# EAGLE board 6_channel_esp32_energy_meter (EAGLE 9.6.2)
CREVISION: 1.0; DESIGNER: Tisham Dhar
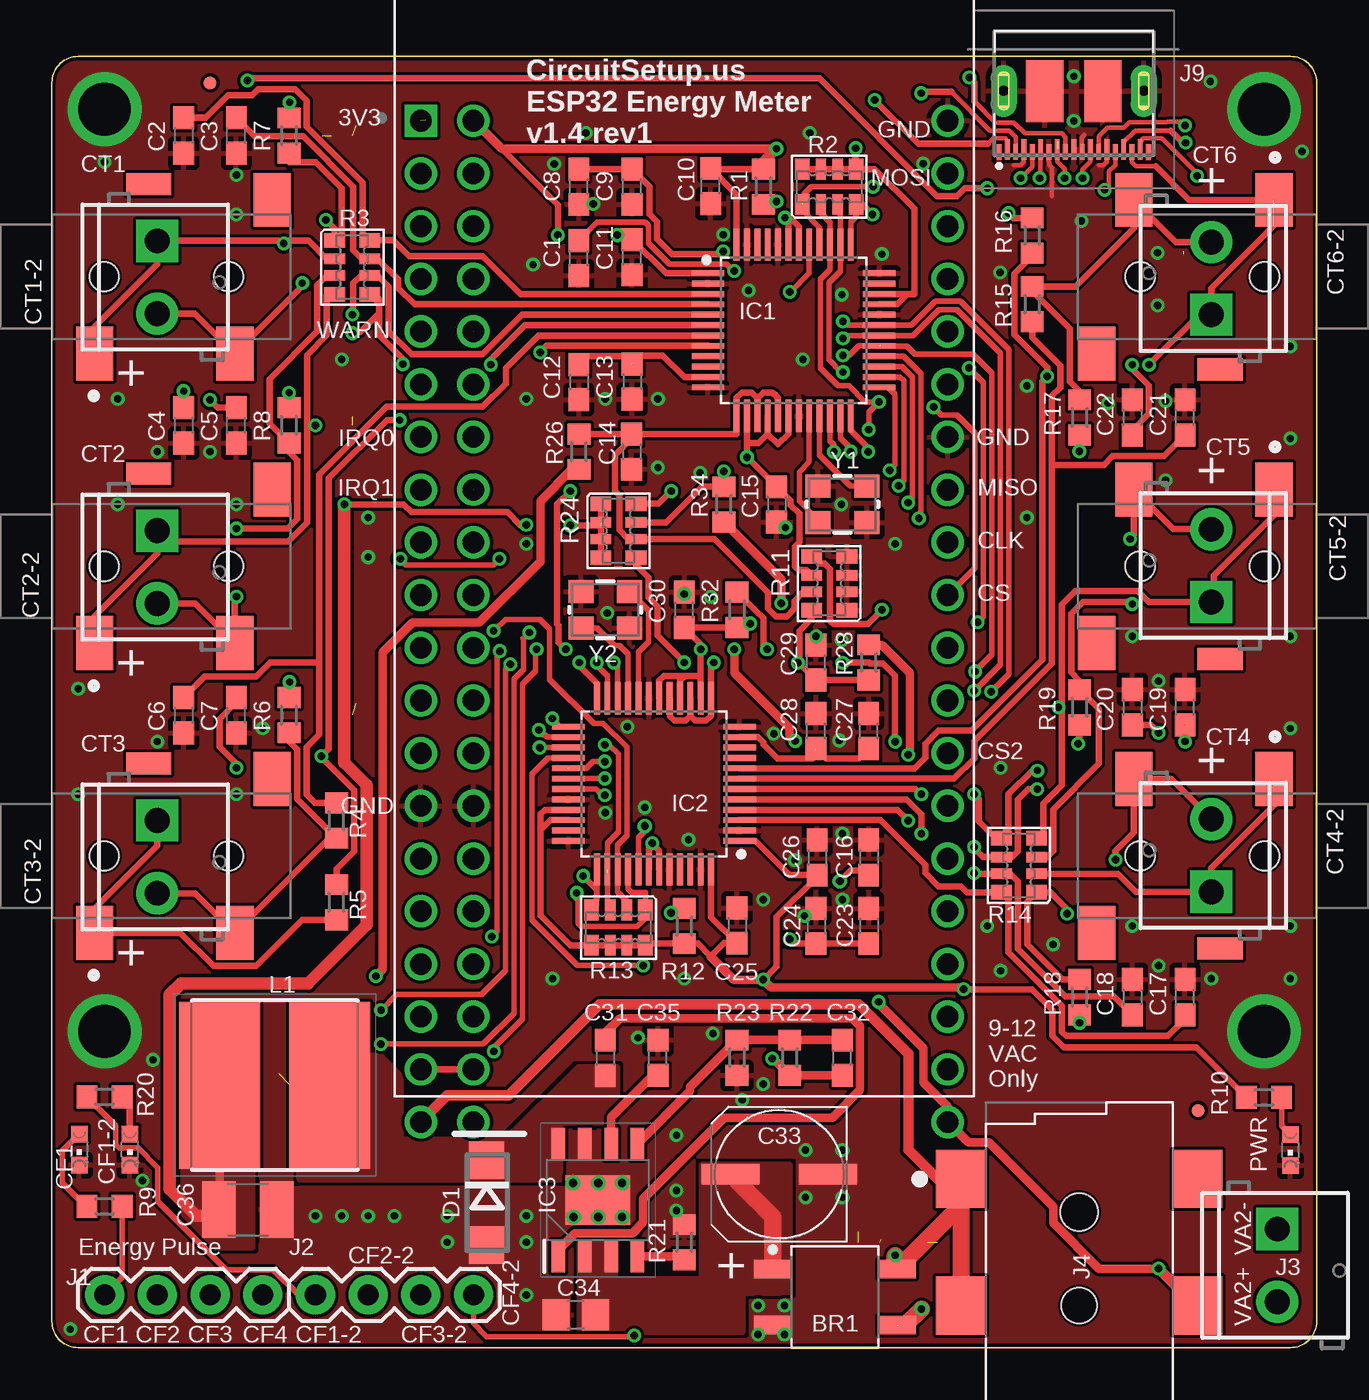
[diagram p3: board, top side]
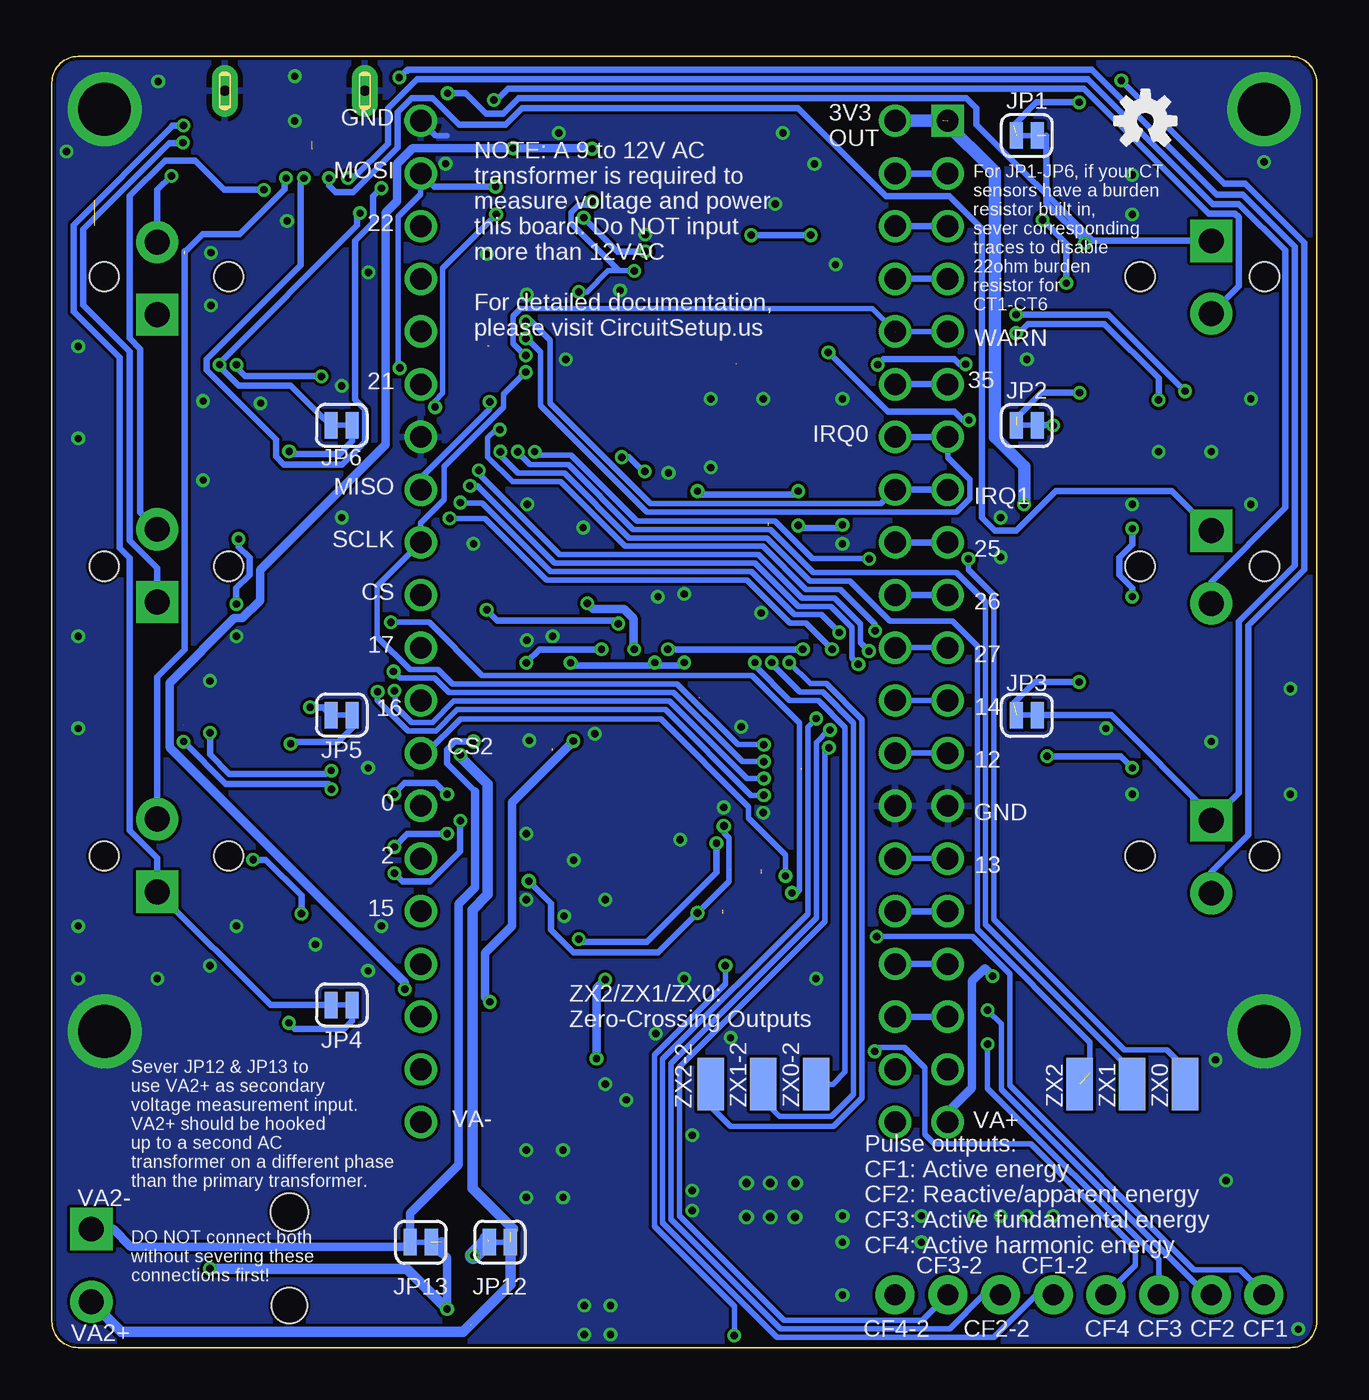
[diagram p4: board, bottom side, seen from below]

Size 60.96 x 62.23 mm. Coordinates in mm from the lower left corner, seen from the top.
Outline: 60.96,60.96 60.96,1.27 arc-90 59.69,0 1.27,0 arc-90 0,1.27 0,60.96 arc-90 1.27,62.23 59.69,62.23 arc-90 60.96,60.96
Copper layers (1*16): Top 0.035mm / dielectric 1.5mm / Bottom 0.035mm
Design rules "hackvana *": minimum track width 5mil, minimum drill 0.3mm, track to track 6mil, track to pad 6mil, pad to pad 6mil, via to via 6mil, smd to smd 0mil, copper to edge 6mil, drill to drill 6mil, minimum pad ring 8mil, minimum via ring 6mil, stop-mask expansion 4mil, vias tented up to drill 25mil, thermal gap 10mil
Net classes: 0 default: width 0.152 mm, drill 0.33 mm, clearance 0.152 mm; 1 pwr: width 0.305 mm, drill 0.356 mm, clearance 0.152 mm; 2 analog: width 0.203 mm, drill 0.33 mm, clearance 0.152 mm

## Footprints (pad centres in the part's own frame; a part is rotated, then mirrored left to right if it is on the bottom)
SOP270P700X270-4 = smd 1.803 x 0.88: 1 -3.005,1.35; 2 -3.005,-1.35; 3 3.005,-1.35; 4 3.005,1.35
C0603 = smd 1.1 x 1: 1 -0.85,0; 2 0.85,0
UD-6,3X7,7_NICHICON = smd 2.8 x 1: + 2.35,0; - -2.35,0
C0805 = smd 1.3 x 1.5: 1 -0.95,0; 2 0.95,0
C1210 = smd 1.6 x 2.7: 1 -1.4,0; 2 1.4,0
CHIPLED_0603 = smd 0.8 x 0.8: A 0,-0.75; C 0,0.75
SCREWTERMINAL-3.5MM-2 = drill 1.2 pad 2.032 square: 1 0,0 | drill 1.2 pad 2.032: 2 3.5,0
CUI_SJ2-35813B-SMT-TR = smd 1.8 x 2.6: 1 -3.7,-3.7; 2 3.05,-3.7; 10 4.85,3.7 | smd 2.184 x 1.067: 3 -1.1,4.462 | hole 1.4: -3.25,0; 2.75,0
DO214AC = smd 1.8 x 1.7: A 2.05,0; C -2.05,0
FIDUCIAL-MICRO = smd 0.635 x 0.635: 1 0,0
QFP50P900X900X120-48 = smd 1.558 x 0.28: 1 -4.127,2.75; 2 -4.127,2.25; 3 -4.127,1.75; 4 -4.127,1.25; 5 -4.127,0.75; 6 -4.127,0.25; 7 -4.127,-0.25; 8 -4.127,-0.75; 9 -4.127,-1.25; 10 -4.127,-1.75; 11 -4.127,-2.25; 12 -4.127,-2.75; 25 4.127,-2.75; 26 4.127,-2.25; 27 4.127,-1.75; 28 4.127,-1.25; 29 4.127,-0.75; 30 4.127,-0.25; 31 4.127,0.25; 32 4.127,0.75; 33 4.127,1.25; 34 4.127,1.75; 35 4.127,2.25; 36 4.127,2.75 | smd 0.28 x 1.558: 13 -2.75,-4.127; 14 -2.25,-4.127; 15 -1.75,-4.127; 16 -1.25,-4.127; 17 -0.75,-4.127; 18 -0.25,-4.127; 19 0.25,-4.127; 20 0.75,-4.127; 21 1.25,-4.127; 22 1.75,-4.127; 23 2.25,-4.127; 24 2.75,-4.127; 37 2.75,4.127; 38 2.25,4.127; 39 1.75,4.127; 40 1.25,4.127; 41 0.75,4.127; 42 0.25,4.127; 43 -0.25,4.127; 44 -0.75,4.127; 45 -1.25,4.127; 46 -1.75,4.127; 47 -2.25,4.127; 48 -2.75,4.127
SOIC127P600X170-9N = smd 1.525 x 0.65: 1 -2.712,1.905; 2 -2.712,0.635; 3 -2.712,-0.635; 4 -2.712,-1.905; 5 2.712,-1.905; 6 2.712,-0.635; 7 2.712,0.635; 8 2.712,1.905 | smd 2.4 x 3.1: 9 0,0
1X04 = drill 1.016 pad 1.88: 1 0,0; 2 2.54,0; 3 5.08,0; 4 7.62,0
CUI_PJ-002AH-SMT-TR = smd 2.8 x 2.4: 1A 0,0; 1B -6.1,0; 2 -6.1,-11.4; 3 0,-11.4 | hole 1.7: -6.1,-5.7 | hole 1.8: -1.6,-5.7
1X01-SM = drill 1.04: 1 0,0
PKS01940110 = smd 0.23 x 0.75: 1 3.6,5.825; 3 2.8,5.825; 5 2,5.825; 7 1.2,5.825; 9 0.4,5.825; 11 -0.4,5.825; 13 -1.2,5.825; 15 -2,5.825; 17 -2.8,5.825; 19 -3.6,5.825 | smd 0.23 x 1: 2 3.2,5.7; 4 2.4,5.7; 6 1.6,5.7; 8 0.8,5.7; 10 0,5.7; 12 -0.8,5.7; 14 -1.6,5.7; 16 -2.4,5.7; 18 -3.2,5.7 | smd 1.8 x 3: 21 -1.4,2.9; 22 1.4,2.9 | drill 0.5 pad 1.25 long: P$1 -3.375,2.875; P$2 3.375,2.875
1X19 = drill 1.04: 1 0,0; 2 2.54,0; 3 5.08,0; 4 7.62,0; 5 10.16,0; 6 12.7,0; 7 15.24,0; 8 17.78,0; 9 20.32,0; 10 22.86,0; 11 25.4,0; 12 27.94,0; 13 30.48,0; 14 33.02,0; 15 35.56,0; 16 38.1,0; 17 40.64,0; 18 43.18,0; 19 45.72,0
SMT-JUMPER_2_NC_TRACE_SILK = smd 0.635 x 1.27: 1 -0.508,0; 2 0.508,0
INDPM8082X300N = smd 3.9 x 8.05: 1 -2.65,0; 2 2.65,0
R0603 = smd 1 x 1.1: 1 -0.85,0; 2 0.85,0
RA1206-8 = smd 0.7 x 1: 1 -1.3,-0.85; 4 1.3,-0.85; 5 1.3,0.85; 8 -1.3,0.85 | smd 0.5 x 1: 2 -0.4,-0.85; 3 0.4,-0.85; 6 0.4,0.85; 7 -0.4,0.85
MODULE_ESP32-DEVKITC-32D = drill 1.04 square: 1 -12.7,19.76 | drill 1.04: 2 -12.7,17.22; 3 -12.7,14.68; 4 -12.7,12.14; 5 -12.7,9.6; 6 -12.7,7.06; 7 -12.7,4.52; 8 -12.7,1.98; 9 -12.7,-0.56; 10 -12.7,-3.1; 11 -12.7,-5.64; 12 -12.7,-8.18; 13 -12.7,-10.72; 14 -12.7,-13.26; 15 -12.7,-15.8; 16 -12.7,-18.34; 17 -12.7,-20.88; 18 -12.7,-23.42; 19 -12.7,-25.96; 20 12.7,19.76; 21 12.7,17.22; 22 12.7,14.68; 23 12.7,12.14; 24 12.7,9.6; 25 12.7,7.06; 26 12.7,4.52; 27 12.7,1.98; 28 12.7,-0.56; 29 12.7,-3.1; 30 12.7,-5.64; 31 12.7,-8.18; 32 12.7,-10.72; 33 12.7,-13.26; 34 12.7,-15.8; 35 12.7,-18.34; 36 12.7,-20.88; 37 12.7,-23.42; 38 12.7,-25.96
CRYSTAL-SMD-3.2X2.5MM = smd 1.2 x 1.1: 1 -1.175,-0.875; 2 1.175,-0.875; 3 1.175,0.875; 4 -1.175,0.875
SMD1,27-2,54 = smd 1.27 x 2.54: 1 0,0

## Placement (x,y rotation side)
BR1  50V/2A  [SOP270P700X270-4]  37.74,2.44 0 top
C1  0.1uF  [C0603]  25.4,52.51 90 top
C2  18nf  [C0603]  6.35,58.42 270 top
C3  18nf  [C0603]  8.89,58.42 90 top
C4  18nf  [C0603]  6.35,44.45 270 top
C5  18nf  [C0603]  8.89,44.45 90 top
C6  18nf  [C0603]  6.35,30.48 270 top
C7  18nf  [C0603]  8.89,30.48 90 top
C8  10uF  [C0603]  25.4,55.95 90 top
C9  0.1uF  [C0603]  27.97,55.95 90 top
C10  0.1uF  [C0603]  31.75,55.98 90 top
C11  0.1uF  [C0603]  27.97,52.55 90 top
C12  10uF  [C0603]  25.4,46.53 270 top
C13  0.1uF  [C0603]  27.97,46.56 270 top
C14  18nF  [C0603]  27.94,43.18 270 top
C15  18nF  [C0603]  34.92,40.64 270 top
C16  0.1uF  [C0603]  39.37,23.62 270 top
C17  18nf  [C0603]  54.61,16.89 90 top
C18  18nf  [C0603]  52.07,16.89 270 top
C19  18nf  [C0603]  54.61,30.86 90 top
C20  18nf  [C0603]  52.07,30.86 270 top
C21  18nf  [C0603]  54.61,44.83 90 top
C22  18nf  [C0603]  52.07,44.83 270 top
C23  10uF  [C0603]  39.37,20.32 270 top
C24  0.1uF  [C0603]  36.83,20.32 270 top
C25  0.1uF  [C0603]  33.02,20.35 270 top
C26  0.1uF  [C0603]  36.88,23.62 270 top
C27  10uF  [C0603]  39.37,29.72 90 top
C28  0.1uF  [C0603]  36.83,29.72 90 top
C29  18nF  [C0603]  36.83,33.02 90 top
C30  18nF  [C0603]  30.48,35.56 90 top
C31  0.1uF  [C0603]  26.67,13.97 270 top
C32  220pF  [C0603]  38.1,13.97 90 top
C33  100uF/25V  [UD-6,3X7,7_NICHICON]  35.05,8.36 180 top
C34  10uF/25V  [C0805]  25.25,1.57 180 top
C35  10nF  [C0603]  29.21,13.97 90 top
C36  100uF/6.3V/1210  [C1210]  9.45,6.65 0 top
CF1  BLU  [CHIPLED_0603]  1.32,9.55 180 top
CF1-2  BLU  [CHIPLED_0603]  3.76,9.55 180 top
CT1  [SCREWTERMINAL-3.5MM-2]  5.08,53.34 270 top
CT1-2  SJ2-35813B-SMT-TR  [CUI_SJ2-35813B-SMT-TR]  5.77,51.61 0 top
CT2  [SCREWTERMINAL-3.5MM-2]  5.08,39.37 270 top
CT2-2  SJ2-35813B-SMT-TR  [CUI_SJ2-35813B-SMT-TR]  5.77,37.66 0 top
CT3  [SCREWTERMINAL-3.5MM-2]  5.08,25.4 270 top
CT3-2  SJ2-35813B-SMT-TR  [CUI_SJ2-35813B-SMT-TR]  5.77,23.7 0 top
CT4  [SCREWTERMINAL-3.5MM-2]  55.88,21.97 90 top
CT4-2  SJ2-35813B-SMT-TR  [CUI_SJ2-35813B-SMT-TR]  55.19,23.7 180 top
CT5  [SCREWTERMINAL-3.5MM-2]  55.88,35.94 90 top
CT5-2  SJ2-35813B-SMT-TR  [CUI_SJ2-35813B-SMT-TR]  55.19,37.66 180 top
CT6  [SCREWTERMINAL-3.5MM-2]  55.88,49.78 90 top
CT6-2  SJ2-35813B-SMT-TR  [CUI_SJ2-35813B-SMT-TR]  55.19,51.61 180 top
D1  [DO214AC]  20.95,6.99 270 top
FD1  FIDUCIALUFIDUCIAL  [FIDUCIAL-MICRO]  7.62,60.96 0 top
FD2  FIDUCIALUFIDUCIAL  [FIDUCIAL-MICRO]  55.24,11.43 0 top
IC1  ATM90E32AS  [QFP50P900X900X120-48]  35.75,49.03 0 top
IC2  ATM90E32AS  [QFP50P900X900X120-48]  29.02,27.17 180 top
IC3  LMR14020SDDA  [SOIC127P600X170-9N]  26.31,7.11 90 top
J1  [1X04]  10.16,2.54 180 top
J2  [1X04]  20.32,2.54 180 top
J3  [SCREWTERMINAL-3.5MM-2]  59.05,5.71 270 top
J4  9-12VAC  [CUI_PJ-002AH-SMT-TR]  43.81,8.13 90 top
J5  PINHD1X1-SM1X01_SM  [1X01-SM]  20.32,10.87 0 top
J6  PINHD1X1-SM1X01_SM  [1X01-SM]  43.18,10.87 0 top
J8  PINHD1X1-SM1X01_SM  [1X01-SM]  17.78,10.87 0 top
J9  PKS019-4011-0  [PKS01940110]  49.25,63.45 180 top
J16  PINHD-1X19  [1X19]  20.32,59.13 270 top
JP1  [SMT-JUMPER_2_NC_TRACE_SILK]  13.97,58.42 0 bottom
JP2  [SMT-JUMPER_2_NC_TRACE_SILK]  13.97,44.45 0 bottom
JP3  [SMT-JUMPER_2_NC_TRACE_SILK]  13.97,30.48 0 bottom
JP4  [SMT-JUMPER_2_NC_TRACE_SILK]  46.99,16.51 180 bottom
JP5  [SMT-JUMPER_2_NC_TRACE_SILK]  46.99,30.48 180 bottom
JP6  [SMT-JUMPER_2_NC_TRACE_SILK]  46.99,44.45 180 bottom
JP12  [SMT-JUMPER_2_NC_TRACE_SILK]  39.37,5.08 180 bottom
JP13  [SMT-JUMPER_2_NC_TRACE_SILK]  43.18,5.08 0 bottom
L1  3.3uH / 8x8mm  [INDPM8082X300N]  10.74,12.65 180 top
LOGO1  OSHW-LOGOS  [OSHW-LOGO-S]  8.26,59.12 0 bottom
PWR  GRN  [CHIPLED_0603]  59.69,9.53 180 top
R1  10K  [R0603]  34.29,55.95 270 top
R2  10K  [RA1206-8]  37.47,55.95 0 top
R3  100  [RA1206-8]  14.48,52.07 270 top
R4  100  [R0603]  13.72,25.4 270 top
R5  100  [R0603]  13.72,21.46 270 top
R6  22  [R0603]  11.43,30.48 270 top
R7  22  [R0603]  11.43,58.42 270 top
R8  22  [R0603]  11.43,44.45 270 top
R9  1k  [R0603]  2.54,6.81 0 top
R10  1k  [R0603]  58.42,12.06 180 top
R11  1K  [RA1206-8]  37.47,36.83 90 top
R12  10K  [R0603]  30.48,20.32 90 top
R13  10K  [RA1206-8]  27.3,20.24 180 top
R14  100  [RA1206-8]  46.61,23.24 90 top
R15  100  [R0603]  47.24,50.29 90 top
R16  100  [R0603]  47.24,53.59 90 top
R17  22  [R0603]  49.53,44.83 90 top
R18  22  [R0603]  49.53,16.89 90 top
R19  22  [R0603]  49.53,30.86 90 top
R20  1k  [R0603]  2.54,12.09 180 top
R21  20k  [R0603]  30.48,5.08 270 top
R22  34k  [R0603]  35.56,13.97 270 top
R23  10k  [R0603]  33.02,13.97 90 top
R24  20K  [RA1206-8]  27.3,39.37 270 top
R26  20k 1/4W  [R0603]  25.4,43.18 270 top
R28  20k 1/4W  [R0603]  39.37,33.02 90 top
R32  20k 1/4W  [R0603]  33.02,35.56 90 top
R34  20k 1/4W  [R0603]  32.38,40.64 270 top
U1  ESP32-DEVKITC-32D  [MODULE_ESP32-DEVKITC-32D]  30.48,39.37 0 top
Y1  16.384MHz  [CRYSTAL-SMD-3.2X2.5MM]  38.1,40.64 0 top
Y2  16.384MHz  [CRYSTAL-SMD-3.2X2.5MM]  26.67,35.56 180 top
ZX0  WIREPADSMD1,27-254  [SMD1,27-2,54]  6.35,12.7 0 bottom
ZX0-2  WIREPADSMD1,27-254  [SMD1,27-2,54]  24.13,12.7 0 bottom
ZX1  WIREPADSMD1,27-254  [SMD1,27-2,54]  8.89,12.7 0 bottom
ZX1-2  WIREPADSMD1,27-254  [SMD1,27-2,54]  26.67,12.7 0 bottom
ZX2  WIREPADSMD1,27-254  [SMD1,27-2,54]  11.43,12.7 0 bottom
ZX2-2  WIREPADSMD1,27-254  [SMD1,27-2,54]  29.21,12.7 0 bottom

## Tracks (layer width: path | path; a pad name or v marks a point on that pad's centre or on a via)
!CS  (via drill 0.36)
  Top 0.254: R2.4 38.77,54.54 38.5,54.27 IC1.37 | v42.49,45.33 42.88,44.95 43.62,44.95 44.49,44.08 44.49,37.58 U1.29
  Top 0.305: v39.55,54.61 39.06,55.1 R2.4
  Bottom 0.254: v42.49,45.33 42.49,45.62 42.12,45.99 42.12,52.04 v39.55,54.61
!CS-2  (via drill 0.35)
  Top 0.254: 26,21.32 26.27,21.59 IC2.37 | R13.4 26.26,21.35 26.26,22.08 v25.6,22.73
  Top 0.305: 26,21.32 R13.4
  Bottom 0.254: v25.6,22.73 25.6,23.75 27.38,25.53 27.38,26.07 31.61,30.3 41.27,30.3 42.93,28.65 U1.32
!RESET  (via drill 0.36)  (1 unrouted)
  Top 0.254: v35.56,50.88 35.59,50.88 36.5,51.79 IC1.41 | 28.59,54.23 28.58,54.23 | 28.58,54.23 26.27,54.23 C1.2 | 28.58,54.23 28.75,54.07 28.75,53.23 29.77,52.21 32.51,52.21 32.82,51.9 v32.88,51.9
  Top 0.305: R1.2 34.78,55.1 v34.92,55.24
  Bottom 0.254: v35.56,50.88 35.17,50.88 34.16,51.9 v32.88,51.9 33.63,51.9 35.94,54.2 35.94,54.71 35.58,55.07 35.1,55.07 v34.92,55.24
!RESET2  (via drill 0.38)  (1 unrouted)
  Top 0.254: IC2.41 28.27,24.59 28.57,24.89 v28.57,25.13 | R12.2 30.27,20.95 v29.84,20.95
  Top 0.305: C16.2 39.16,22.99 38.48,22.99 v37.97,22.48
  Bottom 0.254: v28.57,25.13 28.57,24.81 28.32,24.56 28.32,22.48 v29.84,20.95
  Bottom 0.305: v37.97,22.48 36.9,21.41 36.9,20.13 35.82,19.05 31.75,19.05 v29.84,20.95
BOOT
  Top 0.406: C31.1 26.67,15.16 27.38,15.88 38.59,15.88 38.96,15.52 38.96,12.42 37.61,11.08 32.4,11.08 28.5,7.18 28.5,6.04 27.97,5.52 25.21,5.52 24.41,4.72 IC3.1
CF1  (via drill 0.36)
  Top 0.254: IC1.25 40.31,46.28 40.62,45.97 40.62,42.53 v40.38,42.28 | v21.21,19.81 21.46,20.06 21.46,33.44 | R9.2 3.39,3.39 J1.4
  Top 0.305: v21.58,33.57 21.46,33.44
  Bottom 0.254: J1.4 2.54,2.62 3.67,3.76 5.92,3.76 14.8,12.64 14.8,18.01 16.6,19.81 v21.21,19.81 | v21.58,33.57 22,33.98 22,34.88 23.25,36.14 24.82,36.14 26.89,38.21 36.48,38.21 40.38,42.11 v40.38,42.28
CF1-2  (via drill 0.36)  (2 unrouted)
  Top 0.254: IC2.25 24.52,29.92 v24.12,30.32 | R20.2 3.08,10.7 3.08,9.79 3.24,9.62 4.16,9.62 5.11,8.68 5.11,7.05 8.4,3.76 10.66,3.76 11.88,2.54 J2.4
  Bottom 0.254: J2.4 13.52,2.54 15.55,0.51 26.01,0.51 31.52,6.02 31.52,13.92 24.53,20.91 24.53,29.92 v24.12,30.32
CF2  (via drill 0.35, 0.36)
  Top 0.254: IC1.26 40.88,46.78 41.06,46.6 41.06,41.79 v40.81,41.54 | v22.09,32.94 21.86,32.71 21.86,18.18 20.71,17.02 16.62,17.02 v15.86,16.26
  Bottom 0.254: v15.86,16.26 15.2,15.6 15.2,12.45 5.29,2.54 J1.3 | v40.81,41.54 40.47,41.54 36.74,37.81 27.06,37.81 24.98,35.73 23.42,35.73 22.4,34.72 22.4,33.25 v22.09,32.94
CF2-2  (via drill 0.36)
  Top 0.254: IC2.26 23.87,29.42 23.76,29.53 23.7,29.53 v23.46,29.77
  Bottom 0.254: J2.3 16.06,2.54 17.68,0.91 25.84,0.91 31.11,6.18 31.11,13.71 24.12,20.7 24.12,29.17 23.52,29.77 v23.46,29.77
CF3  (via drill 0.36)
  Top 0.254: IC1.27 40.97,47.28 41.48,46.78 41.48,40.93 v41.27,40.73 | 22.73,34.18 22.73,32.67 22.27,32.22 22.27,16.11 20.79,14.63 v15.86,14.63
  Top 0.305: v23.01,34.46 22.73,34.18
  Bottom 0.254: v41.27,40.73 41.25,40.7 40.23,40.7 36.93,37.4 27.25,37.4 25.17,35.32 23.87,35.32 v23.01,34.46 | v15.86,14.63 15.86,12.5 7.62,4.26 J1.2
CF3-2  (via drill 0.36)
  Top 0.254: IC2.27 v23.51,28.92
  Bottom 0.254: v23.51,28.92 23.71,28.72 23.71,20.53 30.71,13.54 30.71,6.35 25.67,1.32 19,1.32 J2.2
CF4  (via drill 0.35, 0.36)  (1 unrouted)
  Top 0.254: v41.79,39.97 41.88,40.06 41.88,46.95 41.05,47.78 IC1.28 | 23.31,33.61 23.31,32.61 22.68,31.97 22.68,15.84 21.3,14.46 v21.3,14.28
  Top 0.305: v23.36,33.66 23.31,33.61
  Bottom 0.254: J1.1 8.74,3.96 8.74,4.78 13.77,9.81 18.43,9.81 18.89,10.27 18.89,13.48 19.88,14.47 21.14,14.47 21.3,14.31 v21.3,14.28 | v41.79,39.97 40.09,39.97 37.12,36.99 27.46,36.99 25.38,34.92 24.61,34.92 v23.36,33.66
CF4-2  (via drill 0.35, 0.36)
  Top 0.254: IC2.28 23.91,28.42 23.13,27.64 23.13,20.6 25.32,18.41 v28.5,18.41 | v28.07,0.58 28.02,0.53 20.95,0.53 20.32,1.17 J2.1
  Bottom 0.254: v28.5,18.41 28.5,17.52 31.93,14.1 31.93,5.84 28.07,1.98 v28.07,0.58
FB
  Top 0.406: IC3.5 30.76,12.36 30.76,12.56 R23.2 R22.1 C32.2
GND  (via drill 0.35, 0.36, 0.4, 2.54)
  Top 0.229: J9.11 49.65,58.34 49.76,58.45 | 50.47,56.98 50.68,56.98 50.85,57.16 J9.14 | 46.36,56.98 46.68,56.98 46.85,57.16 J9.4 | J9.7 48.04,57.16 48.07,57.14 48.07,57 48.2,56.87 48.2,55.5
  Bottom 0.254: U1.20 42.47,58.42 41.91,58.42
  other vias: 2.54,57.15 8.89,56.52 2.54,59.69 58.42,59.69 2.54,15.24 36.2,47.62 38.05,40.64 40.01,52.7 33.58,50.95 38.07,50.75 29.21,45.72 41.99,57.06 5.08,43.18 7.62,43.18 15.24,40.01 5.08,29.21 10.16,29.84 4.37,8.05 1.27,26.67 1.27,31.75 3.17,40.64 3.17,45.72 8.89,40.64 8.89,26.67 8.89,54.61 26.67,45.72 22.86,45.72 13.97,47.62 55.88,17.78 53.34,18.41 38.1,24.77 58.42,15.24 28.57,26.04 26.77,35.41 27.73,29.93 30.68,24.49 26.67,25.78 34.29,21.59 53.34,32.13 46.99,40.01 50.9,45.52 59.69,48.26 59.69,43.81 59.69,34.29 59.69,29.84 59.69,20.32 52.07,34.29 52.07,20.32 45.72,27.94 40.64,38.73 25.12,7.92 26.34,7.92 27.48,6.3 26.34,6.3 36.32,7.24 38.1,7.24 30.1,10.24 19.05,5.08 28.25,14.93 35.36,39.52 29.21,42.42 36.83,34.29 16.51,6.35 15.24,6.35 22.86,5.08 26.09,55.12 36.27,20.8 22.86,38.73 59.69,17.78 0.89,0.89 48.26,19.43 30.48,36.32 22.86,2.54 25.15,6.3 27.48,7.92 19.05,6.35 31.75,36.2 37.95,29.26 4.88,13.87 22.86,6.35 45.72,18.16 38.1,21.59 34.04,2.03 35.31,2.03 34.04,0.64 35.31,0.64 13.97,6.35 30.1,6.6 38.1,9.53 36.32,9.53 30.1,7.57 31.86,15.14 24.13,17.78 30.48,17.78 12.7,6.35 31.24,42.16 34.8,29.59 34.29,12.7 33.27,11.94 35.81,23.5 45.09,20.32 38.07,34.09 24.21,57.05 36.53,58.55 15.24,38.1 32.36,53.64 49.62,54.31 53.3,52.77 60.26,57.65 55.84,61.02 53.3,50.23 45.7,51.82 25.73,58.55 23.19,52.2 53.67,41.81 53.67,45.62 46.99,46.35 49.26,61.28 49.26,59.12
  pour Top (rank 2): 0,62.23 61,62.23 61,0 0,0
  pour Bottom (rank 2): -0.64,62.87 61.59,62.87 61.59,-0.64 -0.64,-0.64
  pour Bottom (no thermals): 27.75,8.18 27.75,6.05 24.9,6.05 24.9,8.18
  pour Top (no thermals): 10.16,8.33 11.48,8.33 11.48,7.62 24.94,7.62 24.94,10.34 30.89,10.34 30.89,5.44 23.47,5.44 23.47,3.12 10.16,3.12
  pour Top (no thermals): 21.34,4.22 21.34,0.76 24.84,0.76 24.84,2.74 23.52,2.74 23.52,4.27 21.39,4.27
  pour Top (no thermals): 36.02,9.25 39.12,9.25 39.12,7.82 38.56,7.26 36.02,7.26
  pour Top (no thermals): 33.73,2.18 36.12,2.18 36.12,0.36 33.73,0.36
IA+  (via drill 0.35)
  Top 0.203: v39.66,60.13 v39.65,60.12
  Top 0.229: J9.2 46.05,58.17 45.95,58.28 45.38,58.28 45.12,58.01
  Top 0.305: R7.2 11.43,57.13 12.71,57.13 13.96,55.87 13.96,53.7 R3.1 13.63,53.94 v13.21,54.36 | CT1.2 6.89,49.84 CT1-2.2 12.06,51.16 v12.06,51.31 | v39.65,60.12 41.76,58.01 45.12,58.01
  Bottom 0.305: v13.21,54.36 12.06,53.21 v12.06,51.31 | v39.66,60.13 39.52,60.13 38.98,60.67 11.21,60.67 5.2,54.66 3.94,54.66 3.76,54.48 3.76,51.16 CT1.2
IA+-2  (via drill 0.35)  (1 unrouted)
  Top 0.203: J9.12
  Top 0.229: v49.67,56.36 49.67,56.77 50.06,57.16 J9.12
  Top 0.305: R18.2 48.71,17.74 47.02,19.43 47.02,21.5 R14.1 48.15,21.94 48.3,21.8 48.3,21.77 48.93,21.14 v48.93,20.91 | CT4.2 53.95,27.4 CT4-2.2 52.14,24.82 51.26,23.94 v51.26,23.51
  Bottom 0.305: v51.26,23.51 50.66,23.51 48.93,21.79 v48.93,20.91 | CT4.2 55.88,32.32 54.56,33.64 54.56,52.7 | 54.56,52.84 54.56,52.8 53.69,53.67 51.91,53.67 49.75,55.84 49.75,56.29 v49.67,56.36
IA-  (via drill 0.35, 0.36)  (1 unrouted)
  Top 0.229: J9.3 46.45,58.35 46.14,58.66 45.2,58.66 43.34,60.52
  Top 0.305: 13.35,52.47 R3.2 13.25,52.47 12.38,53.34 11.3,53.34 v11.18,53.21 11.05,53.34 CT1.1 5.08,52.23 2.07,49.21 CT1-2.1 | 43.34,60.52 41.95,60.52 v41.89,60.46
  Bottom 0.305: v11.18,53.21 11.18,53.31 13.03,55.17 13.03,58.42 | v41.89,60.46 41.03,60.46 40.04,59.47 39.22,59.47 38.48,60.22 16.88,60.22 16.39,59.73 16.39,58.95 10.78,53.34 CT1.1
IA--2  (via drill 0.35)
  Top 0.203: 50.46,57.73 50.45,57.73 J9.13
  Top 0.229: 50.46,57.73 50.46,58.38 50.86,58.78 51.66,58.78 51.93,59.05 53.73,59.05 53.76,59.08 54.44,59.08 v54.62,58.9
  Top 0.305: CT4-2.1 58.89,26.13 55.88,23.11 CT4.1 52.24,21.97 51.37,22.84 R14.2
  Bottom 0.305: JP4.2 50.42,16.51 CT4.1 55.88,23.6 57.2,24.92 57.2,38.05 57.7,38.54 57.7,47.72 59.91,49.93 59.91,54.1 55.13,58.88 55.16,58.9 v54.62,58.9
IAN
  Top 0.305: C3.2 9.79,58.38 12.11,58.38 14.52,55.96 14.52,52.89 14.95,52.47 R3.7 15.71,52.47 16.7,51.48 16.7,51.06 17.48,50.28 IC1.4
IAN-2  (via drill 0.36)  (1 unrouted)
  Top 0.305: C18.2 51.17,16.94 48.85,16.94 46.56,19.23 46.56,22.47 46.12,22.91 45.83,22.91 R14.7 44.47,22.84 v44.45,22.86 | v41.27,25.4 40.76,25.92 IC2.4
  Bottom 0.305: v41.27,25.4 41.27,23.92 42.73,22.46 44.06,22.46 v44.45,22.85 v44.45,22.86
IAP
  Top 0.305: C2.1 7.41,59.27 8.49,60.35 9.65,60.35 9.95,60.65 11.72,60.65 12.29,60.09 12.29,58.84 14.98,56.15 14.98,53.72 R3.8 16.44,53.37 17.22,52.6 20.77,52.6 22.59,50.78 IC1.3
IAP-2
  Top 0.305: C17.1 54.61,15.83 53.79,15.01 48.89,15.01 48.67,15.23 48.67,16.47 46.11,19.04 46.11,21.59 R14.8 44.1,21.94 43.81,22.23 42.74,22.23 42.09,22.87 42.09,23.26 39.93,25.42 IC2.3
IB+  (via drill 0.35)
  Top 0.229: J9.5 47.25,56.92 46.72,56.39 46.69,56.39 v46.69,56.36
  Top 0.305: R3.3 13.25,51.67 12.79,51.22 12.79,48.99 10.49,46.69 10.49,44.54 R8.2 11.43,43.17 11.82,42.78 11.82,39.93 11.37,39.47 v8.89,39.47 | CT2.2 6.9,35.87 CT2-2.2 8.82,36.12 v8.89,36.2
  Bottom 0.305: v8.89,39.47 8.89,38.7 9.52,38.07 9.52,37.24 8.89,36.61 v8.89,36.2 | CT2.2 5.08,36.91 1.51,40.48 1.51,52.88 3.75,55.12 5.01,55.12 11.03,61.13 43.37,61.13 44.76,59.74 44.76,58.03 46.43,56.36 v46.69,56.36
IB+-2  (via drill 0.35)
  Top 0.229: v50.74,55.8 50.95,56.01 50.95,56.69 51.25,57 J9.15
  Top 0.305: v52.07,35.84 51.97,35.94 49.7,35.94 49.14,35.38 49.14,32.53 49.53,32.14 R19.2 50.47,30.77 50.47,28.15 48.26,25.95 48.26,23.94 47.95,23.63 47.47,23.63 R14.3 | v51.96,38.97 52.14,39.15 CT5-2.2 54.06,39.44 CT5.2
  Bottom 0.305: v52.07,35.84 52.07,36.61 51.44,37.24 51.44,38.07 51.96,38.59 v51.96,38.97 | CT5.2 56.69,40.25 56.69,48.13 57.2,48.64 57.2,55.51 55.49,57.21 54.06,57.21 52.65,55.8 v50.74,55.8
IB-  (via drill 0.35)
  Top 0.229: J9.6 47.65,56.51 47.6,56.46 v47.6,56.36
  Top 0.305: 12.29,44.45 12.29,47.84 13.25,48.8 13.25,50.71 13.47,50.93 R3.4 | 12.29,44.45 v12.7,44.45 | CT2.1 | CT2.1 5.08,38.27 2.07,35.26 CT2-2.1 | 12.29,44.45 12.29,39.75 11.38,38.84 5.61,38.84 CT2.1
  Bottom 0.305: JP2.2 v12.7,44.45 | CT2.1 6.98,41.27 12.57,41.27 14.47,39.37 15.5,39.37 16.13,40 16.13,53.94 17.7,55.51 20.77,55.51 25,59.74 38.29,59.74 39.09,58.93 41.32,58.93 42.6,60.22 43.63,60.22 44.3,59.54 44.3,57.83 46.45,55.68 47.28,55.68 47.6,56 v47.6,56.36
IB--2  (via drill 0.35)
  Top 0.229: J9.16 51.65,58.09 52.22,58.66 53.93,58.66
  Top 0.305: 48.67,30.86 48.67,35.81 49.32,36.47 52.33,36.47 52.86,35.94 CT5.1 56.01,35.94 56.01,37.21 58.89,40.1 CT5-2.1 | 48.67,30.86 48.67,27.11 47.79,26.23 47.79,24.87 R14.4 | 48.67,30.86 v48.51,30.86 | 53.93,58.66 54.51,58.08 v54.64,58.08
  Bottom 0.305: v48.51,30.86 47.88,30.86 JP5.2 | CT5.1 55.88,37.57 57.2,38.89 57.2,47.99 59.45,50.24 59.45,53.91 55.3,58.05 54.67,58.05 v54.64,58.08
IBN  (via drill 0.35)  (1 unrouted)
  Top 0.305: C5.2 8,45.3 v7.62,45.68 | v14.48,48.9 14.51,48.93 14.86,48.93 15.78,49.85 15.78,50.32 R3.5 15.55,50.77 15.78,50.54 15.78,48.79 16.92,47.65 v16.92,47.4 | IC1.6 22.81,49.28 21.16,47.62 v21.16,47.38
  Bottom 0.305: v7.62,45.68 7.62,46.72 10.23,49.33 13.92,49.33 14.36,48.9 v14.48,48.9 | v16.92,47.4 17.22,47.4 17.46,47.64 20.89,47.64 v21.16,47.38
IBN-2  (via drill 0.35, 0.36)
  Top 0.305: C20.2 52.96,30.01 v53.34,29.64 | IC2.6 41.62,26.92 41.87,26.67 v41.91,26.67 | v44.45,26.67 44.68,26.44 44.68,25.37 45.51,24.54 R14.5 45.76,24.67 46.11,25.02 46.11,26.68 47.24,27.81 v47.5,27.81
  Bottom 0.305: v53.34,29.64 53.34,28.59 52.41,27.66 47.78,27.66 47.63,27.8 v47.5,27.8 v47.5,27.81 | v41.91,26.67 42.46,27.22 43.96,27.22 44.45,26.73 v44.45,26.67
IBP  (via drill 0.35)
  Top 0.305: C4.1 v6.35,46.1 | IC1.5 22.66,49.78 20.77,47.88 17.33,47.88 16.24,48.98 16.24,51.14 15.71,51.67 R3.6 14.89,51.67 14.52,51.3 14.52,49.83 v14.48,49.79
  Bottom 0.305: v6.35,46.1 10.04,49.79 v14.48,49.79
IBP-2  (via drill 0.35, 0.36)  (3 unrouted)
  Top 0.305: C19.1 v54.61,29.21 | IC2.5 41.18,26.42 41.91,25.69 v41.91,24.77 | v44.45,24.13 44.45,24.05 44.86,23.64 R14.6 46.27,23.64 46.56,23.94 46.56,26.42 47.06,26.92 v47.49,26.92
  Bottom 0.305: v54.61,29.21 52.57,27.17 47.62,27.17 47.49,27.05 v47.49,26.92 | v41.91,24.77 41.93,24.75 43.83,24.75 v44.45,24.13
IC+  (via drill 0.35, 0.36)  (1 unrouted)
  Top 0.229: v48.81,56.36 48.81,56.8 48.45,57.16 48.45,58.15
  Top 0.305: R6.2 11.43,29.21 11.82,28.82 11.82,26.45 R4.2 13.37,24.55 CT3-2.2 6.91,21.9 CT3.2 | v9.42,61.07 9.52,61.17 36.98,61.17 42.65,55.51 43.63,55.51 44,55.88 v45.09,55.88
  Bottom 0.305: CT3.2 5.08,22.94 3.3,24.71 3.3,34.8 0.6,37.51 0.6,53.26 3.44,56.11 4.46,56.11 v9.42,61.07 | v45.09,55.88 45.48,55.49 45.48,54.21 46.33,53.35 46.33,45.69 45.86,45.21 45.86,43.66 46.96,42.56 49.78,42.56 50.16,42.93 50.16,43.76 53.51,47.11 53.51,47.63 48.97,52.17 48.97,56.12 48.81,56.28 v48.81,56.36
IC+-2  (via drill 0.35)
  Top 0.203: CT6-2.2 52.45,55.62
  Top 0.229: J9.18 52.45,58.12 52.6,58.28 53.5,58.28 55.19,56.59
  Top 0.305: R17.2 49.53,46.1 49.06,46.57 49.06,49.11 47.24,50.92 R15.2 49.33,51.14 52.14,53.96 CT6-2.2 54.17,53.28 CT6.2 | v55.19,56.46 55.19,56.59
  Bottom 0.305: v55.19,56.46 55.22,56.46 55.88,55.8 CT6.2
IC-  (via drill 0.35)
  Top 0.203: J9.9
  Top 0.229: J9.9 48.85,58.02 48.86,58.02 48.86,58.33 48.67,58.53 46.89,58.53 46.37,59.04 45.47,59.04 44.45,60.06
  Top 0.305: R5.2 12.06,20.61 9.84,18.39 7.79,18.39 6.18,20 CT3-2.1 2.07,21.17 5.08,24.19 CT3.1 | v44.22,61.21 44.45,60.98 44.45,60.06
  Bottom 0.305: JP3.2 9.9,30.48 5.08,25.66 CT3.1 3.76,26.72 3.76,34.99 1.05,37.7 1.05,53.07 3.56,55.58 4.82,55.58 10.84,61.59 43.81,61.59 43.81,61.54 43.89,61.54 v44.22,61.21
IC--2  (via drill 0.35)  (1 unrouted)
  Top 0.229: J9.17 52.05,57.12 52.23,56.94 53.2,56.94
  Top 0.305: 47.58,54.11 R16.2 46.34,54.44 v46.11,54.68 | 58.89,54.07 55.88,51.05 CT6.1 55.29,49.78 v52.88,47.37 | CT6-2.1 54.83,55.31 53.2,56.94
  Bottom 0.305: JP6.2 47.88,44.83 47.92,44.83 49.45,46.35 51.95,46.35 52.7,47.11 52.7,47.24 52.83,47.37 v52.88,47.37 52.88,47.46 46.25,54.09 46.25,54.54 v46.11,54.68
ICN  (via drill 0.35, 0.36)
  Top 0.305: v16.76,44.7 16.15,44.7 13.35,41.9 13.35,28.85 v12.99,28.5 12.99,28.45 14.57,26.88 14.57,23.92 13.72,23.07 R5.1 | C7.2 8.89,31.11 8.09,30.31 8.09,28.95 8.89,28.15 v8.89,27.94 | IC1.8 23.85,48.28 v23.54,47.97
  Bottom 0.305: v16.76,44.7 17.06,44.7 17.46,45.1 20.67,45.1 v23.54,47.97 | v8.89,27.94 9.45,28.5 v12.99,28.5
ICN-2  (via drill 0.35)
  Top 0.305: C22.2 52.07,44.2 52.88,45.01 52.88,46.36 52.07,47.16 v52.07,47.37 | R16.1 47.24,52.62 46.39,51.77 46.39,48.82 47.97,47.23 v47.97,46.81 47.74,46.58 47.74,45.97 47.74,33.16 44.32,29.73 42.73,29.73 42.09,29.1 42.09,28.45 41.57,27.92 IC2.8
  Bottom 0.305: v47.97,46.81 51.64,46.81 52.07,47.24 v52.07,47.37
ICP
  Top 0.305: 12.89,33.02 12.89,42.09 16.14,45.34 20.77,45.34 21.89,46.47 21.89,47.22 23.45,48.78 IC1.7 | 12.89,33.02 12.89,29.56 12.28,28.96 12.28,26.67 12.7,26.25 R4.1 | 12.89,33.02 10.51,33.02 9.84,32.35 7.37,32.35 C6.1
ICP-2
  Top 0.305: 48.2,42.55 48.2,45.88 48.6,46.28 48.6,47.32 47.24,48.68 R15.1 | 48.2,42.55 48.2,32.97 44.47,29.24 44.47,28.4 43.48,27.42 IC2.7 | 48.2,42.55 50.7,42.55 51.12,42.96 53.59,42.96 C21.1
IO12
  Bottom 0.254: U1.13 J16.13
IO13
  Bottom 0.254: U1.15 J16.15
IO14
  Bottom 0.254: U1.12 J16.12
IO25
  Bottom 0.305: U1.9 J16.9
IO26
  Bottom 0.305: U1.10 J16.10
IO27
  Bottom 0.254: U1.11 J16.11
IO35
  Bottom 0.305: U1.6 J16.6
IRQ0  (via drill 0.36)
  Top 0.254: v38.12,48.64 38.26,48.78 IC1.30 41.49,48.78 42.74,50.03 43.62,50.03 45.71,47.94 45.71,32.92 v44.45,31.66 | IC2.30 v26.63,27.42
  Top 0.305: v26.63,27.42 v26.64,27.43
  Bottom 0.254: v26.64,27.43 27.46,27.43 31.18,31.16 41.59,31.16 42.62,30.13 43.62,30.13 44.42,30.93 44.42,31.62 v44.45,31.66 | U1.7 17.78,42.88 16.72,41.83 16.72,40.91 17.37,40.27 32.29,40.27 37.41,45.39 37.41,47.98 38.08,48.64 v38.12,48.64
  Bottom 0.305: U1.7 J16.7
IRQ1  (via drill 0.36)  (2 unrouted)
  Top 0.254: v38.12,49.45 38.3,49.28 IC1.31 41.42,49.28 42.57,50.44 43.79,50.44 46.12,48.1 46.12,32.46 v45.26,31.61 | IC2.31 26.22,26.92 26.52,26.62
  Top 0.305: 26.52,26.62 v26.64,26.62
  Bottom 0.254: 37.85,49.45 36.96,48.56 36.96,45.51 32.12,40.67 21,40.67 J16.8 | v26.64,26.62 27.26,26.62 31.39,30.75 41.42,30.75 42.45,29.72 43.79,29.72 45.28,31.22 45.28,31.59 v45.26,31.61
  Bottom 0.305: v38.12,49.45 37.85,49.45 | U1.8 J16.8
MISO  (via drill 0.36)  (2 unrouted)
  Top 0.254: R2.2 37.06,54.67 37.5,54.23 IC1.39 37.5,51.96 37.03,51.49 37.03,47.21 37.89,46.35 38.41,46.35 39.19,45.58 v39.86,45.58 39.37,45.09 v39.37,44.25 | 27.7,21.53 27.27,21.97 IC2.39 27.27,24.24 27.71,24.68 27.71,28.94 26.57,30.09 26.12,30.09 24,32.21 24,34.63 23.53,35.1 21.86,35.1 21.31,34.55 v21.29,34.55
  Top 0.305: 27.7,21.53 R13.2
  Bottom 0.254: v39.86,45.58 39.86,45.23 43.18,41.91 U1.27 | v21.29,34.55 21.29,34.88 22.95,36.54 24.61,36.54 26.68,38.62 33.34,38.62 36.45,41.73 38.76,41.73 39.95,42.93 39.95,43.85 39.56,44.25
  Bottom 0.305: 39.56,44.25 v39.37,44.25
MOSI  (via drill 0.35, 0.36)  (4 unrouted)
  Top 0.254: IC1.40 37,53.98 36.16,54.82 R2.1 | IC2.40 27.77,22.12 27.95,21.94 28.61,21.94 R13.1 28.51,21 28.51,20.59 28.21,20.29 25.53,20.29 25.35,20.47 25.35,21.59 | 25.29,21.65 v25.29,21.91 | 36.26,55.32 36.26,55.6 36.61,55.96 v39.58,55.96 | v44.62,34.96 44.9,35.24 44.9,46.51 v44.2,47.21
  Top 0.305: 36.16,55.28 36.18,55.3 | 28.61,20.92 28.59,20.9 | 25.35,21.59 25.29,21.65 | 36.26,55.32 36.16,55.23 R2.1
  Bottom 0.254: 25.08,21.91 24.93,22.05 24.93,30.11 27.22,32.4 40.22,32.4 42.78,34.96 v44.62,34.96 | v44.2,47.21 44.27,47.29 44.27,54.51 43.18,55.6 U1.21
  Bottom 0.305: v25.29,21.91 25.08,21.91 | v39.58,55.96 42.55,55.96 U1.21
N$1  (via drill 0.35)  (1 unrouted)
  Top 0.305: 11.78,59.27 R7.1 11.46,59.3 v11.46,60.02
  Bottom 0.305: v11.46,60.02 13.51,60.02 14.63,58.9
N$2  (via drill 0.35)  (1 unrouted)
  Top 0.305: R8.1 11.37,45.36 11.43,45.43 v11.43,46.02
  Bottom 0.305: 14.48,44.88 14.41,44.88 13.27,46.02 v11.43,46.02
N$3
  Top 0.254: R9.1 1.64,6.81 0.51,7.94 0.51,9.49 CF1.A
N$4  (via drill 0.35)  (1 unrouted)
  Top 0.305: R6.1 11.46,31.36 v11.46,32.08
  Bottom 0.305: v11.46,32.08 13.59,32.08 14.63,31.04
N$5  (via drill 0.36)
  Top 0.305: v49.53,15.65 R18.1
  Bottom 0.305: JP4.1 46.48,15.75 46.86,15.37 49.25,15.37 v49.53,15.65
N$6  (via drill 0.36)
  Top 0.305: v49.45,29.11 49.53,29.18 R19.1
  Bottom 0.305: JP5.1 46.48,29.87 47.17,29.18 49.38,29.18 v49.45,29.11
N$7  (via drill 0.36)
  Top 0.305: R17.1 v49.53,43.2 v49.52,43.2
  Bottom 0.305: JP6.1 46.48,43.69 47.1,43.07 49.4,43.07 v49.52,43.2
N$8
  Bottom 0.305: U1.2 J16.2
N$9
  Bottom 0.305: U1.3 J16.3
N$12
  Top 0.254: PWR.A 59.27,10.7 R10.1
N$14
  Top 0.305: R20.1 3.76,11.72 CF1-2.A
N$15
  Bottom 0.305: U1.4 J16.4
N$16
  Bottom 0.305: U1.16 J16.16
N$17
  Bottom 0.305: U1.17 J16.17
N$18
  Bottom 0.305: U1.18 J16.18
N$19
  Top 0.305: U1.19 J16.19
OSCI
  Top 0.254: IC1.20 36.5,42.67 36.02,42.19 36.02,40.8 36.92,39.89 Y1.1
OSCI2
  Top 0.254: IC2.20 28.27,33.53 28.75,34.01 28.75,35.53 Y2.1
OSCO
  Top 0.254: IC1.21 37,43.01 38.5,41.52 Y1.3
OSCO2
  Top 0.254: IC2.21 27.77,33.42 27.36,33.83 27.12,33.83 26.26,34.69 Y2.3
RT
  Top 0.406: IC3.4 30.31,4.4 R21.2
SCLK  (via drill 0.36)  (1 unrouted)
  Top 0.254: v38.12,47.02 38.04,47.02 37.44,47.62 37.44,51.32 38,51.88 IC1.38 38,54.73 37.87,54.86 | 26.7,29.01 26.91,29.01 27.3,28.61 27.3,24.85 26.77,24.32 IC2.38 | 26.91,21.21 26.77,21.34 26.77,22.84
  Top 0.305: R2.3 37.87,54.86 | 26.7,29.01 v26.64,29.06 | R13.3 26.91,21.21
  Bottom 0.254: v26.64,29.06 27.89,29.06 30.82,31.99 41.66,31.99 42.34,32.67 43.71,32.67 45.28,34.25 45.28,36.71 U1.28 43.18,39.75 42.06,40.87 42.06,42.46 39.19,45.32 39.19,45.95 v38.12,47.02
SS
  Top 0.406: C35.1 28.98,13.12 26.95,11.09 IC3.6
SW
  pour Top (no thermals): 24.49,10.85 24.49,8.1 11.94,8.1 11.94,14.07 15.85,14.07 16.81,13.11 16.81,10.01 21.84,10.01 25.35,13.51 27.23,13.51 27.23,10.85
VA2+  (via drill 0.36)  (1 unrouted)
  Top 0.406: R28.2 40.01,33.87 41.35,32.52 41.35,28.65 v41.27,28.57
  Bottom 0.305: 38.73,5.71 38.86,5.59
  Bottom 0.508: v41.27,28.57 41.27,28.48 39.95,27.16 39.95,21.84 40.69,21.11 40.69,7.67 38.73,5.71 | JP12.1 38.86,3.05 41.14,0.77 57.61,0.77 J3.2
VA2-  (via drill 0.36)
  Top 0.305: R32.2 33.9,35.53 33.92,35.53 34.29,35.16 34.29,33.83 v34.47,33.66 | v38.1,33.01 38.11,33.02 39.37,33.02 39.41,32.98 40.05,32.98 40.64,32.38 v40.64,29.21
  Bottom 0.305: v40.64,29.21 41.54,29.21 41.91,28.84 41.91,28.14 40.56,26.8 | v34.47,33.66 37.45,33.66 v38.1,33.01
  Bottom 0.406: 40.56,26.8 40.56,22.18 41.35,21.39 41.35,8.81 43.69,6.48 JP13.1 43.92,4.85 57.15,4.85 58.02,5.71 J3.1
VA+  (via drill 0.35, 0.36)  (1 unrouted)
  Top 0.406: v15.62,17.91 15.93,18.22 15.93,33.49 17.39,34.94 20.6,34.94 23.54,37.89 23.54,40.8 25.07,42.33 R26.2
  Top 0.508: J4.1A 42.67,8.13 41.27,9.53 41.27,14.16 38.9,16.54 26.4,16.54 22.01,12.15 19.06,12.15 J8.1
  Top 0.813: J4.1B J4.1A 43.81,6.85 BR1.4 40.64,3.9 v40.64,4.45
  Bottom 0.406: v15.62,17.91 16,18.29 16.62,17.66 16.62,12.52 17.78,11.37 J8.1
  Bottom 0.813: v40.64,4.45 39.95,5.13 39.95,5.23
VA-  (via drill 0.36)  (2 unrouted)
  Top 0.406: 55.12,2.03 J4.2 | v39.85,16.66 39.85,16.56 41.99,14.42 41.99,12.78 43.18,11.6 J6.1 44.17,9.88 45.16,9.88 48.26,6.79 48.26,6.01 50.46,3.81 v53.34,3.81 | R34.2 35.15,37.02 v35.15,35.88 | v32.89,33.66 32.89,32.51 35.55,29.86 35.55,29.52 v35.83,29.23
  Top 0.508: v53.34,3.81 55.12,2.03
  Top 0.813: v41.91,1.85 41.12,1.07 40.77,1.07
  Bottom 0.305: v39.85,16.66 40.08,16.89 | 32.92,33.68 v32.89,33.66
  Bottom 0.406: 40.08,16.89 40.08,19.02 38.79,20.32 38.79,26.28 v35.83,29.23 | v41.91,1.85 41.91,4.32 42.19,4.6 | v35.15,35.88 34.88,35.61 33.4,35.61 32.92,35.13 32.92,33.68
  Bottom 0.508: 42.19,5.08 42.19,4.6 | v53.34,3.81 43.87,3.81 v41.91,1.85
VAN  (via drill 0.36)
  Top 0.305: R24.7 29.61,39.77 31.33,41.49 R34.1 v32.38,42.24 | R11.6 36.37,37.48 35.99,37.48 35.81,37.65 35.81,38.61 36.02,38.82 36.02,40.19 35.59,40.62 35.59,40.83 C15.1 v33.5,42.91 33.5,43.59 | IC1.14 33.5,43.59 | IC1.18 35.5,44.03 35,43.54 34.5,44.04 | IC1.16 34.5,44.04 | 34.5,44.04 34.05,43.59 33.5,43.59
  Bottom 0.305: v33.5,42.91 33.14,42.91 32.47,42.24 v32.38,42.24
VAN2  (via drill 0.36)
  Top 0.305: 31.27,32.38 v31.27,33.66 31.27,33.92 C30.1 R32.1 33.47,34.71 v33.66,34.9 | 31.27,32.38 IC2.14 | R11.5 36.96,37.78 37.24,37.78 37.51,37.52 37.51,35.05 37.69,34.88 39.32,34.88 v40.01,35.56 | R24.8 29.23,40.67 v29.84,41.28 | v24.77,33.65 24.43,33.99 24.43,34.81 24.36,34.88 24.36,40.65 v24.99,41.28 | 31.27,32.38 30.5,32.38 | 30.5,32.38 30.27,32.15 IC2.16 | IC2.18 29.27,32.15 29.5,32.38 30.5,32.38
  Bottom 0.305: v33.66,34.9 33.81,35.05 39.5,35.05 v40.01,35.56 | v29.84,41.28 29.69,41.12 25.15,41.12 v24.99,41.28 | v24.77,33.65 v24.77,33.66 v31.27,33.66
VAP
  Top 0.305: C14.1 33,44.03 IC1.13 33,45.78 33.25,46.02 33.73,46.02 34,45.75 | R26.1 C14.1 | C14.1 27.94,43.81 27.14,43.01 27.14,41.27 27.35,41.06 27.35,39.39 27.77,38.97 R24.6 31.94,38.97 34.51,36.4 34.51,35.62 34.89,35.24 35.42,35.24 35.79,35.61 35.79,35.98 36.23,36.43 R11.7 | IC1.15 34,45.75 | 34,45.75 34.28,46.04 34.72,46.04 34.8,45.95 34.82,45.95 35,45.77 IC1.17
VAP2  (via drill 0.36)  (1 unrouted)
  Top 0.305: v30.48,33.02 29.18,34.32 29.18,35.71 28.75,36.14 28.75,37.11 28.16,37.71 R24.5 | v31.91,33.02 31.77,32.88 IC2.13 31.77,30.45 31.54,30.21 31,30.21 30.77,30.45 | R11.8 36.62,35.14 36.02,34.55 36.02,32.98 C29.1 | R28.1 C29.1 | C29.1 35.99,33.01 v35.96,33.01 | 30.77,30.45 IC2.15 | 29.78,31.32 29.79,31.32 29.79,30.43 30,30.21 30.54,30.21 30.77,30.45
  Bottom 0.305: v30.48,33.02 30.63,32.87 31.75,32.87 v31.91,33.02 32.06,32.87 35.82,32.87 v35.96,33.01
VDD  (via drill 0.36)  (4 unrouted)
  Top 0.305: R2.8 R2.7 R2.6 R2.5 38.73,56.83 v38.73,57.81 | 33.94,56.8 R1.1 | R2.5 39.65,56.81 41.57,54.89 41.57,50.78 41.11,50.78 | R12.1 28.68,19.47 R13.8 R13.7 R13.6 R13.5 24.99,19.39 24.66,19.73 23.56,20.82 23.56,24.94 | 30.9,19.47 R12.1 | 36.91,22.8 36.9,22.79 | 36.9,22.79 C26.2 35.56,22.77 33.91,24.42 IC2.1 | IC1.1 29.59,51.78 C11.2 27.57,53.8 27.43,53.8 v27.25,53.62 | R10.2 55.16,14.48 48.78,14.48 | 48.78,14.48 48.77,14.48 | IC1.48 33,55.58 C10.2 31.78,56.8 R1.1 | R1.1 34.29,56.58 | 23.56,24.94 24.04,25.42 IC2.34 | IC2.33 23.76,25.92 23.56,25.72 23.56,24.94 | 41.11,50.78 41.11,50.72 41.19,50.72 40.76,50.28 IC1.33 | 41.11,50.78 IC1.34 | v43.94,17.27 47.23,17.27 48.22,16.28 48.22,15.04 48.78,14.48 | R12.1 31.13,19.47 31.75,18.85 32.4,19.5 C25.2 31.77,20.75 IC2.48 | 36.9,22.79 36.9,22.72 34.92,20.75 34.92,18.37 v34.29,17.73 | v14.1,40.64 16.96,40.64 17.33,40.27 21.96,40.27 22.57,39.66 v22.86,39.66 | R24.1 R24.2 | 26.44,39.62 v24.99,39.62 26.42,39.62 26.45,39.59 R24.3 R24.4 | v24.38,53.62 24.38,55.07 J16.1
  Top 0.406: C32.1 R22.2 34.74,13.94 v34.71,13.94 | 34.19,17.73 v34.29,17.73 | v34.29,17.73 32.87,17.73 31.75,18.85 | L1.2 8.09,6.51 8.26,6.35 | v34.29,17.73 34.67,17.35 43.86,17.35 v43.94,17.27 | v34.92,57.78 21.67,57.78 J16.1
  Top 0.508: v34.92,57.78 34.29,57.15 R1.1
  Top 0.61: L1.2 8.09,15.09 | v14.1,40.64 14.1,28.21 15.18,27.13 15.18,20.38 12.35,17.55 6.22,17.55 5.69,17.02 5.69,7.62 6.96,6.35 8.35,6.35 C36.1
  Bottom 0.305: v43.94,17.27 43.94,17.58 | J16.1 | v24.99,39.62 24.86,39.5 23.02,39.5 v22.86,39.66 | v27.25,53.62 v24.38,53.62
  Bottom 0.406: v34.29,17.73 34.71,17.31 v34.71,13.94 | 20.32,59.08 J16.1 | 43.94,17.58 55.29,28.93 55.29,32.03 52.17,35.15 51.79,35.15 50.93,36.01 50.93,37.47 44.88,43.52 44.88,54.69 44.32,55.25 44.32,57.06 43.57,57.81 v38.73,57.81 34.95,57.81 v34.92,57.78
  Bottom 0.61: v14.1,40.64 14.1,42.47 15.52,43.9 15.52,56.67 18.01,59.16 | J16.1 U1.1
  pour Top (no thermals): 6.35,8.94 6.35,4.88 6.4,4.83 9.65,4.83 9.65,8.94
VDD2  (via drill 0.36)
  Top 0.305: IC2.42 28.77,24.09 28.77,24.1 28.77,24.15 v28.93,24.31 29.27,23.97 IC2.43 | C23.2 C24.2 35.77,19.47 v35.56,19.68
  Bottom 0.305: v35.56,19.68 35.43,19.56 32.28,19.56 28.93,22.91 v28.93,24.31
VDD18  (via drill 0.36)
  Top 0.305: IC1.43 35.5,54.29 v35.33,54.46 35.53,54.46 35.69,54.3 35.73,54.3 36,54.03 IC1.42 | C8.2 C9.2 28.8,55.96 28.8,54.63 29.18,54.26 29.18,53.41 29.88,52.7 32.23,52.7 v32.36,52.83
  Bottom 0.305: v35.33,54.46 33.71,52.83 v32.36,52.83
VIN
  Top 0.813: C33.+ 34.74,6.32 BR1.1
  pour Top (no thermals): 25.45,0.76 33.27,0.76 33.27,2.64 35.56,2.64 35.56,8.81 31.34,8.81 31.34,3.3 27.13,3.3 27.13,4.98 25.45,4.98
VREF  (1 unrouted)
  Top 0.305: 27.96,47.42 27.88,47.34 28.34,47.82 29.44,47.82 30.48,46.78 IC1.11 | C13.1 27.58,47.79 25.81,47.79 C12.1
VREF2  (1 unrouted)
  Top 0.305: IC2.11 34.03,29.42 34.29,29.16 34.29,29.07 34.96,28.41 36.66,28.41 36.84,28.58 36.84,28.79 | C27.1 38.89,28.39 37.31,28.39 C28.1
WARN  (via drill 0.36)  (4 unrouted)
  Top 0.254: v38.12,47.83 38.44,47.83 38.89,48.28 39.95,48.28 | v26.64,28.25 26.08,28.25 25.75,27.92 24.82,27.92 | v44.49,32.59 45.31,33.4 45.31,46.96 44.38,47.89 41.59,47.89 41.21,48.26 39.89,48.26 IC1.29
  Bottom 0.254: v26.64,28.25 27.68,28.25 31.01,31.58 41.82,31.58 42.51,32.27 44.17,32.27 v44.49,32.59 | J16.5 U1.5 | 38.11,47.84 38.28,48.01 38.35,48.01 38.73,48.39 38.73,49.71 38.38,50.06 21.41,50.06 J16.5
  Bottom 0.305: v38.12,47.83 38.11,47.84
ZX0  (via drill 0.35, 0.36)
  Top 0.254: v37.69,43.18 37.69,43.5 37.5,43.69 IC1.22 | v16.79,38.02 v16.79,38.01 17.08,37.73 21.27,37.73 v21.57,38.02
  Bottom 0.254: 6.35,13.49 7.21,14.35 9.27,14.35 15.55,20.63 15.55,36.27 16.79,37.51 v16.79,38.02 | v37.69,43.18 37.52,43.01 35.93,43.01 32.77,39.84 26.12,39.84 24.3,38.02 v21.57,38.02
  Bottom 0.305: 6.35,13.49 ZX0.1
ZX0-2  (via drill 0.35)
  Top 0.254: v27.08,33.02 27.12,33.02 27.27,32.87 IC2.22
  Bottom 0.254: v27.08,33.02 27.08,32.87 25.4,31.19 24.02,31.19 22.73,29.9 22.73,13.29 23.32,12.7 ZX0-2.1
ZX1  (via drill 0.36)
  Top 0.254: IC1.23 38,43.84 38.5,43.33 v38.5,43.18
  Bottom 0.254: 8.89,13.32 15.96,20.39 15.96,35.95 17.37,37.35 24.25,37.35 26.33,39.43 32.96,39.43 36.07,42.55 37.92,42.55 38.5,43.13 v38.5,43.18
  Bottom 0.305: 8.89,13.32 ZX1.1
ZX1-2  (via drill 0.36)
  Top 0.254: IC2.23 26.77,32.37 26.27,32.87 v26.27,33.02
  Bottom 0.254: ZX1-2.1 26.67,11.94 25.88,11.15 23.38,11.15 22.32,12.21 22.32,30.11 23.8,31.6 24.9,31.6 26.27,32.97 v26.27,33.02
ZX2  (via drill 0.36)  (1 unrouted)
  Top 0.254: v39.34,43.18 39.34,43.35 38.5,44.2 IC1.24
  Bottom 0.254: 10.92,13.21 10.92,14.71 16.36,20.15 16.36,33.81 17.56,35.01 20.56,35.01 22.5,36.95 24.42,36.95 26.5,39.03 33.15,39.03 36.26,42.14 38.49,42.14 39.34,43
  Bottom 0.305: 39.34,43 v39.34,43.18
ZX2-2  (via drill 0.36)
  Top 0.254: v25.43,33.02 25.43,32.85 26.27,32.01 IC2.24
  Bottom 0.254: v25.43,33.02 24.41,32 23.63,32 21.91,30.28 21.91,12.04 23.29,10.67 28.24,10.67 29.21,11.63 ZX2-2.1

## Text on the board
tPlace: + | + | + | + | + | + | 9-12 / VAC / Only | Energy Pulse | VA2- | + | VA2+
bPlace: For JP1-JP6, if your CT / sensors have a burden / resistor built in, / sever corresponding / traces to disable / 22ohm burden / resistor for / CT1-CT6 | VA+ | VA- | Sever JP12 & JP13 to / use VA2+ as secondary / voltage measurement input. / VA2+ should be hooked / up to a second AC / transformer on a different phase / than the primary transformer. / / / DO NOT connect both / without severing these / connections first! | VA2+
tNames: 3V3 | GND | CircuitSetup.us / ESP32 Energy Meter / v1.4 rev1 | MOSI | WARN | IRQ0 | GND | IRQ1 | MISO | CLK | CS | CS2 | GND | CF2-2 | CF4-2 | CF1 | CF2 | CF3 | CF4 | CF1-2 | CF3-2
bNames: GND | 3V3 / OUT | MOSI | 22 | NOTE: A 9 to 12V AC / transformer is required to / measure voltage and power / this board. Do NOT input / more than 12VAC / / For detailed documentation, / please visit CircuitSetup.us | WARN | 21 | 35 | IRQ0 | MISO | IRQ1 | SCLK | 25 | CS | 26 | 17 | 27 | 16 | 14 | CS2 | 12 | 0 | GND | 2 | 13 | 15 | ZX2/ZX1/ZX0: / Zero-Crossing Outputs | VA2- | Pulse outputs: / CF1: Active energy / CF2: Reactive/apparent energy / CF3: Active fundamental energy / CF4: Active harmonic energy | CF1-2 | CF3-2 | CF1 | CF2 | CF3 | CF4 | CF2-2 | CF4-2